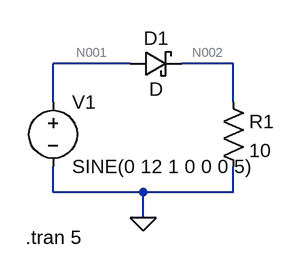
[diagram p0: schematic Draft2.asc]
Draft2.asc, the LTspice schematic file:
Version 4
SHEET 1 880 680
WIRE 160 96 64 96
WIRE 288 96 224 96
WIRE 64 144 64 96
WIRE 288 144 288 96
WIRE 64 256 64 224
WIRE 176 256 64 256
WIRE 288 256 288 224
WIRE 288 256 176 256
WIRE 176 288 176 256
FLAG 176 288 0
SYMBOL voltage 64 128 R0
WINDOW 123 0 0 Left 0
WINDOW 39 0 0 Left 0
SYMATTR InstName V1
SYMATTR Value SINE(0 12 1 0 0 0 5)
SYMBOL res 272 128 R0
SYMATTR InstName R1
SYMATTR Value 10
SYMBOL schottky 160 112 R270
WINDOW 0 32 32 VTop 2
WINDOW 3 0 32 VBottom 2
SYMATTR InstName D1
TEXT 30 312 Left 2 !.tran 5

The netlist it stands for:
* Draft2.asc
V1 N001 0 SINE(0 12 1 0 0 0 5)
R1 N002 0 10
D1 N001 N002 D
.model D D
.lib standard.dio
.tran 5
.backanno
.end

* Results of the author's LTspice run, read from the files saved beside the schematic
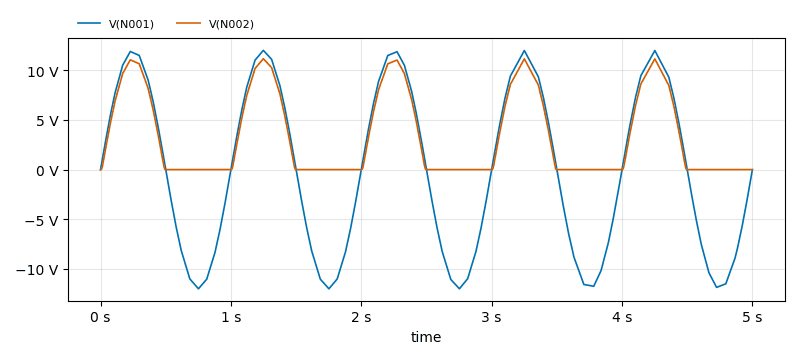
[diagram p1: Transient Analysis of Draft2.asc, plotted from the saved traces]
* Transient Analysis, 1 run:
*   V(N001): min -12 V, max 12 V, average -20.24 mV, rms 8.394 V, last 0 V
*   V(N002): min 0 V, max 11.16 V, average 3.355 V, rms 5.394 V, last 0 V